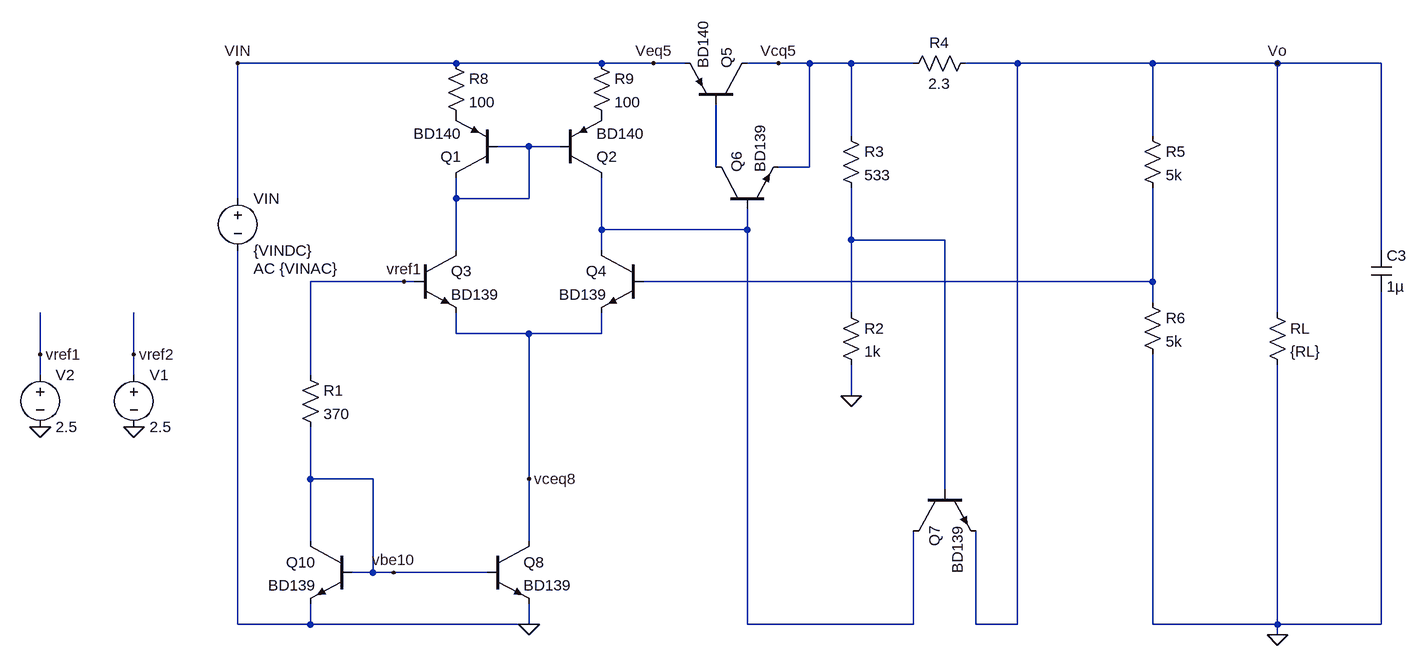
[diagram p0: schematic Regulador Lineal_Kicad.asc]
Regulador Lineal_Kicad.asc, the LTspice schematic file:
Version 4.1
SHEET 1 3580 1080
WIRE 96 -32 -240 -32
WIRE 320 -32 96 -32
WIRE 400 -32 320 -32
WIRE 448 -32 400 -32
WIRE 592 -32 544 -32
WIRE 640 -32 592 -32
WIRE 704 -32 640 -32
WIRE 800 -32 704 -32
WIRE 960 -32 880 -32
WIRE 1168 -32 960 -32
WIRE 1360 -32 1168 -32
WIRE 1520 -32 1360 -32
WIRE 704 80 704 -32
WIRE 1168 80 1168 -32
WIRE 208 96 160 96
WIRE 256 96 208 96
WIRE 496 128 496 32
WIRE 640 128 640 -32
WIRE 640 128 592 128
WIRE -240 176 -240 -32
WIRE 96 176 96 144
WIRE 208 176 208 96
WIRE 208 176 96 176
WIRE 320 224 320 144
WIRE 544 224 544 192
WIRE 544 224 320 224
WIRE 704 240 704 160
WIRE 848 240 704 240
WIRE 96 256 96 176
WIRE 320 256 320 224
WIRE 1520 256 1520 -32
WIRE 16 304 -128 304
WIRE 32 304 16 304
WIRE 1168 304 1168 160
WIRE 1168 304 384 304
WIRE 1168 336 1168 304
WIRE 704 352 704 240
WIRE 1360 352 1360 -32
WIRE 96 384 96 352
WIRE 208 384 96 384
WIRE 320 384 320 352
WIRE 320 384 208 384
WIRE -544 416 -544 352
WIRE -400 416 -400 352
WIRE -544 448 -544 416
WIRE -400 448 -400 416
WIRE -128 448 -128 304
WIRE 704 480 704 432
WIRE -128 608 -128 528
WIRE -32 608 -128 608
WIRE 208 608 208 384
WIRE 848 624 848 240
WIRE -128 704 -128 608
WIRE 208 704 208 608
WIRE -32 752 -32 608
WIRE -32 752 -64 752
WIRE 0 752 -32 752
WIRE 144 752 0 752
WIRE -240 832 -240 256
WIRE -128 832 -128 800
WIRE -128 832 -240 832
WIRE 208 832 208 800
WIRE 208 832 -128 832
WIRE 544 832 544 224
WIRE 800 832 800 688
WIRE 800 832 544 832
WIRE 896 832 896 688
WIRE 960 832 960 -32
WIRE 960 832 896 832
WIRE 1168 832 1168 416
WIRE 1360 832 1360 432
WIRE 1360 832 1168 832
WIRE 1520 832 1520 320
WIRE 1520 832 1360 832
WIRE 1360 848 1360 832
FLAG 1360 -32 Vo
FLAG -240 -32 VIN
FLAG 1360 848 0
FLAG 208 832 0
FLAG -400 416 vref2
FLAG -400 528 0
FLAG 704 480 0
FLAG 0 752 vbe10
FLAG -544 416 vref1
FLAG -544 528 0
FLAG 16 304 vref1
FLAG 208 608 vceq8
FLAG 400 -32 Veq5
FLAG 592 -32 Vcq5
SYMBOL pnp 160 144 R180
SYMATTR InstName Q1
SYMATTR Value BD140
SYMBOL pnp 256 144 M180
SYMATTR InstName Q2
SYMATTR Value BD140
SYMBOL npn 32 256 R0
SYMATTR InstName Q3
SYMATTR Value BD139
SYMBOL npn 384 256 M0
SYMATTR InstName Q4
SYMATTR Value BD139
SYMBOL pnp 544 32 M270
SYMATTR InstName Q5
SYMATTR Value BD140
SYMBOL npn 496 192 R270
SYMATTR InstName Q6
SYMATTR Value BD139
SYMBOL voltage -240 160 R0
WINDOW 123 24 124 Left 2
WINDOW 39 0 0 Left 0
SYMATTR Value2 AC {VINAC}
SYMATTR InstName VIN
SYMATTR Value {VINDC}
SYMBOL res 80 -48 R0
SYMATTR InstName R8
SYMATTR Value 100
SYMBOL res 304 -48 R0
SYMATTR InstName R9
SYMATTR Value 100
SYMBOL cap 1504 256 R0
SYMATTR InstName C3
SYMATTR Value 1µ
SYMBOL res 688 64 R0
SYMATTR InstName R3
SYMATTR Value 533
SYMBOL res 688 336 R0
SYMATTR InstName R2
SYMATTR Value 1k
SYMBOL res 896 -48 R90
WINDOW 0 0 56 VBottom 2
WINDOW 3 32 56 VTop 2
SYMATTR InstName R4
SYMATTR Value 2.3
SYMBOL npn 800 624 M90
SYMATTR InstName Q7
SYMATTR Value BD139
SYMBOL res 1152 64 R0
SYMATTR InstName R5
SYMATTR Value 5k
SYMBOL res 1152 320 R0
SYMATTR InstName R6
SYMATTR Value 5k
SYMBOL npn 144 704 R0
SYMATTR InstName Q8
SYMATTR Value BD139
SYMBOL npn -64 704 M0
SYMATTR InstName Q10
SYMATTR Value BD139
SYMBOL voltage -400 432 R0
WINDOW 123 0 0 Left 0
WINDOW 39 0 0 Left 0
SYMATTR InstName V1
SYMATTR Value 2.5
SYMBOL res 1344 336 R0
SYMATTR InstName RL
SYMATTR Value {RL}
SYMBOL res -144 432 R0
SYMATTR InstName R1
SYMATTR Value 370
SYMBOL voltage -544 432 R0
WINDOW 123 0 0 Left 0
WINDOW 39 0 0 Left 0
SYMATTR InstName V2
SYMATTR Value 2.5

The netlist it stands for:
* Regulador Lineal_Kicad.asc
Q1 N001 N001 P001 0 BD140
Q2 N003 N001 P002 0 BD140
Q3 N001 vref1 vceq8 0 BD139
Q4 N003 N005 vceq8 0 BD139
Q5 Vcq5 N002 Veq5 0 BD140
Q6 N002 N003 Vcq5 0 BD139
VIN Veq5 0 {VINDC} AC {VINAC}
R8 Veq5 P001 100
R9 Veq5 P002 100
C3 Vo 0 1µ
R3 Vcq5 N004 533
R2 N004 0 1k
R4 Vo Vcq5 2.3
Q7 N003 N004 Vo 0 BD139
R5 Vo N005 5k
R6 N005 0 5k
Q8 vceq8 vbe10 0 0 BD139
Q10 vbe10 vbe10 0 0 BD139
V1 vref2 0 2.5
RL Vo 0 {RL}
R1 vref1 vbe10 370
V2 vref1 0 2.5
.model NPN NPN
.model PNP PNP
.lib standard.bjt
.backanno
.end